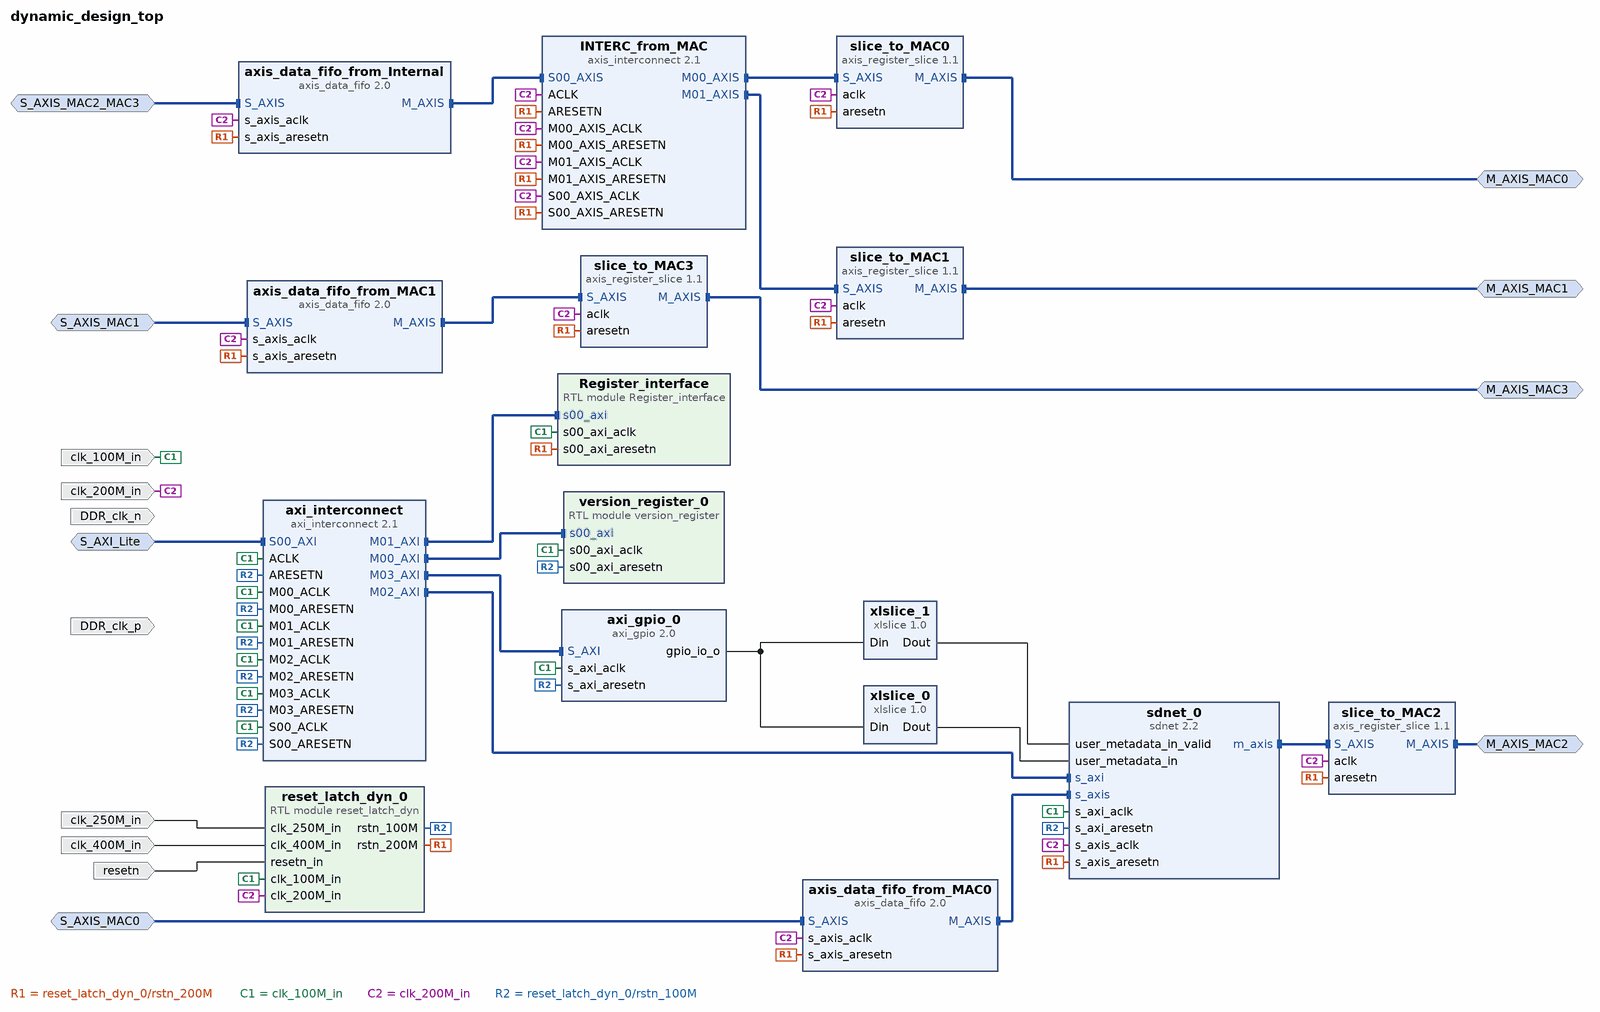
[diagram p0: block diagram of the top level]
# Vivado block design dynamic_design_top, xcu25-ffvc1760-2LV-e, Vivado 2020.1
create_bd_design dynamic_design_top

create_bd_intf_port -mode Master -vlnv xilinx.com:interface:axis_rtl:1.0 M_AXIS_MAC0
set_property -dict {CONFIG.FREQ_HZ 200000000} [get_bd_intf_ports M_AXIS_MAC0]
create_bd_intf_port -mode Master -vlnv xilinx.com:interface:axis_rtl:1.0 M_AXIS_MAC1
set_property -dict {CONFIG.FREQ_HZ 200000000} [get_bd_intf_ports M_AXIS_MAC1]
create_bd_intf_port -mode Master -vlnv xilinx.com:interface:axis_rtl:1.0 M_AXIS_MAC2
set_property -dict {CONFIG.FREQ_HZ 200000000} [get_bd_intf_ports M_AXIS_MAC2]
create_bd_intf_port -mode Master -vlnv xilinx.com:interface:axis_rtl:1.0 M_AXIS_MAC3
set_property -dict {CONFIG.FREQ_HZ 200000000} [get_bd_intf_ports M_AXIS_MAC3]
create_bd_intf_port -mode Slave -vlnv xilinx.com:interface:axis_rtl:1.0 S_AXIS_MAC0
set_property -dict [list \
  CONFIG.TDATA_NUM_BYTES 64 \
  CONFIG.TDEST_WIDTH 2 \
  CONFIG.TID_WIDTH 0 \
  CONFIG.TUSER_WIDTH 0 \
  CONFIG.HAS_TREADY 1 \
  CONFIG.HAS_TSTRB 0 \
  CONFIG.HAS_TKEEP 1 \
  CONFIG.HAS_TLAST 1 \
  CONFIG.FREQ_HZ 200000000 \
  CONFIG.LAYERED_METADATA undef \
] [get_bd_intf_ports S_AXIS_MAC0]
create_bd_intf_port -mode Slave -vlnv xilinx.com:interface:axis_rtl:1.0 S_AXIS_MAC1
set_property -dict [list \
  CONFIG.TDATA_NUM_BYTES 64 \
  CONFIG.TDEST_WIDTH 2 \
  CONFIG.TID_WIDTH 0 \
  CONFIG.TUSER_WIDTH 0 \
  CONFIG.HAS_TREADY 1 \
  CONFIG.HAS_TSTRB 0 \
  CONFIG.HAS_TKEEP 1 \
  CONFIG.HAS_TLAST 1 \
  CONFIG.FREQ_HZ 200000000 \
  CONFIG.LAYERED_METADATA undef \
] [get_bd_intf_ports S_AXIS_MAC1]
create_bd_intf_port -mode Slave -vlnv xilinx.com:interface:axis_rtl:1.0 S_AXIS_MAC2_MAC3
set_property -dict [list \
  CONFIG.TDATA_NUM_BYTES 64 \
  CONFIG.TDEST_WIDTH 2 \
  CONFIG.TID_WIDTH 0 \
  CONFIG.TUSER_WIDTH 0 \
  CONFIG.HAS_TREADY 1 \
  CONFIG.HAS_TSTRB 0 \
  CONFIG.HAS_TKEEP 1 \
  CONFIG.HAS_TLAST 1 \
  CONFIG.FREQ_HZ 200000000 \
  CONFIG.LAYERED_METADATA undef \
] [get_bd_intf_ports S_AXIS_MAC2_MAC3]
create_bd_intf_port -mode Slave -vlnv xilinx.com:interface:aximm_rtl:1.0 S_AXI_Lite
set_property -dict [list \
  CONFIG.DATA_WIDTH 32 \
  CONFIG.PROTOCOL AXI4LITE \
  CONFIG.FREQ_HZ 100000000 \
  CONFIG.ID_WIDTH 0 \
  CONFIG.ADDR_WIDTH 40 \
  CONFIG.AWUSER_WIDTH 0 \
  CONFIG.ARUSER_WIDTH 0 \
  CONFIG.WUSER_WIDTH 0 \
  CONFIG.RUSER_WIDTH 0 \
  CONFIG.BUSER_WIDTH 0 \
  CONFIG.READ_WRITE_MODE READ_WRITE \
  CONFIG.HAS_BURST 1 \
  CONFIG.HAS_LOCK 1 \
  CONFIG.HAS_PROT 1 \
  CONFIG.HAS_CACHE 1 \
  CONFIG.HAS_QOS 1 \
  CONFIG.HAS_REGION 0 \
  CONFIG.HAS_WSTRB 1 \
  CONFIG.HAS_BRESP 1 \
  CONFIG.HAS_RRESP 1 \
  CONFIG.SUPPORTS_NARROW_BURST 0 \
  CONFIG.NUM_READ_OUTSTANDING 2 \
  CONFIG.NUM_WRITE_OUTSTANDING 2 \
  CONFIG.MAX_BURST_LENGTH 1 \
  CONFIG.NUM_READ_THREADS 1 \
  CONFIG.NUM_WRITE_THREADS 1 \
  CONFIG.RUSER_BITS_PER_BYTE 0 \
  CONFIG.WUSER_BITS_PER_BYTE 0 \
] [get_bd_intf_ports S_AXI_Lite]
create_bd_port -dir I -type clk DDR_clk_n
set_property -dict {CONFIG.FREQ_HZ 100000000} [get_bd_ports DDR_clk_n]
create_bd_port -dir I -type clk DDR_clk_p
set_property -dict {CONFIG.FREQ_HZ 100000000} [get_bd_ports DDR_clk_p]
create_bd_port -dir I -type clk clk_100M_in
set_property -dict {CONFIG.FREQ_HZ 100000000} [get_bd_ports clk_100M_in]
create_bd_port -dir I -type clk clk_200M_in
set_property -dict [list \
  CONFIG.ASSOCIATED_BUSIF S_AXIS_MAC0:S_AXIS_MAC1:S_AXIS_MAC2_MAC3:M_AXIS_MAC0:M_AXIS_MAC1:M_AXIS_MAC2:M_AXIS_MAC3 \
  CONFIG.FREQ_HZ 200000000 \
] [get_bd_ports clk_200M_in]
create_bd_port -dir I -type clk clk_250M_in
set_property -dict {CONFIG.FREQ_HZ 250000000} [get_bd_ports clk_250M_in]
create_bd_port -dir I -type clk clk_400M_in
set_property -dict {CONFIG.FREQ_HZ 400000000} [get_bd_ports clk_400M_in]
create_bd_port -dir I -type rst resetn

create_bd_cell -type ip -vlnv xilinx.com:ip:axis_interconnect:2.1 INTERC_from_MAC
set_property -dict [list \
  CONFIG.ARB_ON_TLAST 1 \
  CONFIG.M00_AXIS_BASETDEST 0x00000002 \
  CONFIG.M00_AXIS_HIGHTDEST 0x00000002 \
  CONFIG.M00_FIFO_DEPTH 64 \
  CONFIG.M00_FIFO_MODE 1 \
  CONFIG.M00_HAS_REGSLICE 0 \
  CONFIG.M01_AXIS_BASETDEST 0x00000003 \
  CONFIG.M01_AXIS_HIGHTDEST 0x00000003 \
  CONFIG.M01_FIFO_DEPTH 64 \
  CONFIG.M01_FIFO_MODE 1 \
  CONFIG.M01_HAS_REGSLICE 0 \
  CONFIG.M02_FIFO_DEPTH 32 \
  CONFIG.M02_FIFO_MODE 1 \
  CONFIG.M02_HAS_REGSLICE 1 \
  CONFIG.M03_FIFO_DEPTH 32 \
  CONFIG.M03_FIFO_MODE 1 \
  CONFIG.M03_HAS_REGSLICE 1 \
  CONFIG.NUM_MI 2 \
  CONFIG.S00_FIFO_DEPTH 128 \
  CONFIG.S00_FIFO_MODE 1 \
  CONFIG.S00_HAS_REGSLICE 0 \
] [get_bd_cells INTERC_from_MAC]
create_bd_cell -type module -reference Register_interface Register_interface
create_bd_cell -type ip -vlnv xilinx.com:ip:axi_interconnect:2.1 axi_interconnect
set_property -dict [list \
  CONFIG.M00_HAS_REGSLICE 4 \
  CONFIG.M01_HAS_REGSLICE 4 \
  CONFIG.M02_HAS_REGSLICE 4 \
  CONFIG.M03_HAS_REGSLICE 4 \
  CONFIG.M04_HAS_REGSLICE 4 \
  CONFIG.M05_HAS_REGSLICE 4 \
  CONFIG.M06_HAS_REGSLICE 4 \
  CONFIG.M07_HAS_REGSLICE 4 \
  CONFIG.M08_HAS_REGSLICE 4 \
  CONFIG.M09_HAS_REGSLICE 4 \
  CONFIG.M10_HAS_REGSLICE 4 \
  CONFIG.M11_HAS_REGSLICE 4 \
  CONFIG.M12_HAS_REGSLICE 4 \
  CONFIG.M13_HAS_REGSLICE 4 \
  CONFIG.M14_HAS_REGSLICE 4 \
  CONFIG.M15_HAS_REGSLICE 4 \
  CONFIG.M16_HAS_REGSLICE 4 \
  CONFIG.NUM_MI 4 \
  CONFIG.S00_HAS_REGSLICE 4 \
] [get_bd_cells axi_interconnect]
create_bd_cell -type ip -vlnv xilinx.com:ip:axis_data_fifo:2.0 axis_data_fifo_from_Internal
set_property -dict [list \
  CONFIG.FIFO_DEPTH 64 \
  CONFIG.FIFO_MEMORY_TYPE auto \
  CONFIG.FIFO_MODE 2 \
  CONFIG.HAS_TKEEP 1 \
  CONFIG.TDATA_NUM_BYTES 64 \
  CONFIG.TDEST_WIDTH 2 \
] [get_bd_cells axis_data_fifo_from_Internal]
create_bd_cell -type ip -vlnv xilinx.com:ip:axis_data_fifo:2.0 axis_data_fifo_from_MAC0
set_property -dict [list \
  CONFIG.FIFO_DEPTH 64 \
  CONFIG.FIFO_MEMORY_TYPE auto \
  CONFIG.FIFO_MODE 2 \
  CONFIG.HAS_TKEEP 1 \
  CONFIG.TDATA_NUM_BYTES 64 \
  CONFIG.TDEST_WIDTH 2 \
] [get_bd_cells axis_data_fifo_from_MAC0]
create_bd_cell -type ip -vlnv xilinx.com:ip:axis_data_fifo:2.0 axis_data_fifo_from_MAC1
set_property -dict [list \
  CONFIG.FIFO_DEPTH 64 \
  CONFIG.FIFO_MEMORY_TYPE auto \
  CONFIG.FIFO_MODE 2 \
  CONFIG.HAS_TKEEP 1 \
  CONFIG.TDATA_NUM_BYTES 64 \
  CONFIG.TDEST_WIDTH 2 \
] [get_bd_cells axis_data_fifo_from_MAC1]
create_bd_cell -type module -reference reset_latch_dyn reset_latch_dyn_0
create_bd_cell -type ip -vlnv xilinx.com:ip:axis_register_slice:1.1 slice_to_MAC0
set_property -dict [list \
  CONFIG.HAS_TKEEP 1 \
  CONFIG.HAS_TLAST 1 \
  CONFIG.HAS_TREADY 1 \
  CONFIG.TDATA_NUM_BYTES 64 \
  CONFIG.TDEST_WIDTH 2 \
] [get_bd_cells slice_to_MAC0]
create_bd_cell -type ip -vlnv xilinx.com:ip:axis_register_slice:1.1 slice_to_MAC1
set_property -dict [list \
  CONFIG.HAS_TKEEP 1 \
  CONFIG.HAS_TLAST 1 \
  CONFIG.HAS_TREADY 1 \
  CONFIG.TDATA_NUM_BYTES 64 \
  CONFIG.TDEST_WIDTH 2 \
] [get_bd_cells slice_to_MAC1]
create_bd_cell -type ip -vlnv xilinx.com:ip:axis_register_slice:1.1 slice_to_MAC2
set_property -dict [list \
  CONFIG.HAS_TKEEP 1 \
  CONFIG.HAS_TLAST 1 \
  CONFIG.HAS_TREADY 1 \
  CONFIG.TDATA_NUM_BYTES 64 \
  CONFIG.TDEST_WIDTH 2 \
] [get_bd_cells slice_to_MAC2]
create_bd_cell -type ip -vlnv xilinx.com:ip:axis_register_slice:1.1 slice_to_MAC3
set_property -dict [list \
  CONFIG.HAS_TKEEP 1 \
  CONFIG.HAS_TLAST 1 \
  CONFIG.HAS_TREADY 1 \
  CONFIG.TDATA_NUM_BYTES 64 \
  CONFIG.TDEST_WIDTH 2 \
] [get_bd_cells slice_to_MAC3]
create_bd_cell -type ip -vlnv xilinx.com:ip:axi_gpio:2.0 axi_gpio_0
set_property -dict {CONFIG.C_ALL_OUTPUTS 1 CONFIG.C_GPIO_WIDTH 17} [get_bd_cells axi_gpio_0]
create_bd_cell -type ip -vlnv xilinx.com:ip:xlslice:1.0 xlslice_0
set_property -dict {CONFIG.DIN_FROM 15 CONFIG.DIN_WIDTH 17 CONFIG.DOUT_WIDTH 16} [get_bd_cells xlslice_0]
create_bd_cell -type ip -vlnv xilinx.com:ip:xlslice:1.0 xlslice_1
set_property -dict {CONFIG.DIN_FROM 16 CONFIG.DIN_TO 16 CONFIG.DIN_WIDTH 17 CONFIG.DOUT_WIDTH 1} [get_bd_cells xlslice_1]
create_bd_cell -type ip -vlnv xilinx.com:ip:sdnet:2.2 sdnet_0
set_property -dict [list \
  CONFIG.AXIS_CLK_FREQ_MHZ 200.0 \
  CONFIG.JSON_TIMESTAMP 1632994590 \
  CONFIG.M_AXI_HBM_ADDR_WIDTH 33 \
  CONFIG.M_AXI_HBM_DATA_WIDTH 256 \
  CONFIG.M_AXI_HBM_ID_WIDTH 6 \
  CONFIG.M_AXI_HBM_PROTOCOL 0 \
  CONFIG.P4_FILE /scratch/kestera/projects/DFX/U25N_DFX/dynamic/p4_example/p4_example.srcs/sources_1/echo.p4 \
  CONFIG.PKT_RATE 200.0 \
  CONFIG.S_AXI_ADDR_WIDTH 1 \
  CONFIG.USER_METADATA_ENABLES {metadata.echo_port {input true output true}} \
  CONFIG.USER_META_DATA_WIDTH 16 \
  CONFIG.USER_META_FORMAT {metadata.echo_port {length 16 start 0 end 15}} \
] [get_bd_cells sdnet_0]
create_bd_cell -type module -reference version_register version_register_0

# ---- connections ----

connect_bd_intf_net -intf_net S_AXIS_MAC0_1 [get_bd_intf_ports S_AXIS_MAC0] [get_bd_intf_pins axis_data_fifo_from_MAC0/S_AXIS]
connect_bd_intf_net [get_bd_intf_pins axis_data_fifo_from_MAC0/M_AXIS] [get_bd_intf_pins sdnet_0/s_axis]
connect_bd_intf_net [get_bd_intf_pins axi_interconnect/M03_AXI] [get_bd_intf_pins axi_gpio_0/S_AXI]
connect_bd_intf_net -intf_net S00_AXI_0_1 [get_bd_intf_ports S_AXI_Lite] [get_bd_intf_pins axi_interconnect/S00_AXI]
connect_bd_intf_net [get_bd_intf_pins INTERC_from_MAC/M01_AXIS] [get_bd_intf_pins slice_to_MAC1/S_AXIS]
connect_bd_intf_net [get_bd_intf_pins INTERC_from_MAC/M00_AXIS] [get_bd_intf_pins slice_to_MAC0/S_AXIS]
connect_bd_intf_net -intf_net S_AXIS_MAC1_1 [get_bd_intf_ports S_AXIS_MAC1] [get_bd_intf_pins axis_data_fifo_from_MAC1/S_AXIS]
connect_bd_intf_net -intf_net S_AXIS_MAC2_MAC3_1 [get_bd_intf_ports S_AXIS_MAC2_MAC3] [get_bd_intf_pins axis_data_fifo_from_Internal/S_AXIS]
connect_bd_intf_net [get_bd_intf_pins axi_interconnect/M00_AXI] [get_bd_intf_pins version_register_0/s00_axi]
connect_bd_intf_net [get_bd_intf_pins Register_interface/s00_axi] [get_bd_intf_pins axi_interconnect/M01_AXI]
connect_bd_intf_net [get_bd_intf_pins INTERC_from_MAC/S00_AXIS] [get_bd_intf_pins axis_data_fifo_from_Internal/M_AXIS]
connect_bd_intf_net [get_bd_intf_pins axis_data_fifo_from_MAC1/M_AXIS] [get_bd_intf_pins slice_to_MAC3/S_AXIS]
connect_bd_intf_net -intf_net dynamic_M_AXIS_MAC0 [get_bd_intf_ports M_AXIS_MAC0] [get_bd_intf_pins slice_to_MAC0/M_AXIS]
connect_bd_intf_net -intf_net dynamic_M_AXIS_MAC1 [get_bd_intf_ports M_AXIS_MAC1] [get_bd_intf_pins slice_to_MAC1/M_AXIS]
connect_bd_intf_net -intf_net dynamic_M_AXIS_MAC2 [get_bd_intf_ports M_AXIS_MAC2] [get_bd_intf_pins slice_to_MAC2/M_AXIS]
connect_bd_intf_net -intf_net dynamic_M_AXIS_MAC3 [get_bd_intf_ports M_AXIS_MAC3] [get_bd_intf_pins slice_to_MAC3/M_AXIS]
connect_bd_intf_net [get_bd_intf_pins sdnet_0/s_axi] [get_bd_intf_pins axi_interconnect/M02_AXI]
connect_bd_intf_net [get_bd_intf_pins sdnet_0/m_axis] [get_bd_intf_pins slice_to_MAC2/S_AXIS]
connect_bd_net -net ARESETN_1 [get_bd_pins reset_latch_dyn_0/rstn_200M] \
  [get_bd_pins INTERC_from_MAC/ARESETN] [get_bd_pins INTERC_from_MAC/M00_AXIS_ARESETN] \
  [get_bd_pins INTERC_from_MAC/M01_AXIS_ARESETN] [get_bd_pins INTERC_from_MAC/S00_AXIS_ARESETN] \
  [get_bd_pins Register_interface/s00_axi_aresetn] [get_bd_pins axis_data_fifo_from_Internal/s_axis_aresetn] \
  [get_bd_pins axis_data_fifo_from_MAC0/s_axis_aresetn] [get_bd_pins axis_data_fifo_from_MAC1/s_axis_aresetn] \
  [get_bd_pins slice_to_MAC0/aresetn] [get_bd_pins slice_to_MAC1/aresetn] [get_bd_pins slice_to_MAC2/aresetn] \
  [get_bd_pins slice_to_MAC3/aresetn] [get_bd_pins sdnet_0/s_axis_aresetn]
connect_bd_net [get_bd_ports clk_100M_in] \
  [get_bd_pins Register_interface/s00_axi_aclk] [get_bd_pins axi_interconnect/ACLK] [get_bd_pins axi_interconnect/M00_ACLK] \
  [get_bd_pins axi_interconnect/M01_ACLK] [get_bd_pins axi_interconnect/S00_ACLK] [get_bd_pins reset_latch_dyn_0/clk_100M_in] \
  [get_bd_pins axi_gpio_0/s_axi_aclk] [get_bd_pins axi_interconnect/M03_ACLK] [get_bd_pins axi_interconnect/M02_ACLK] \
  [get_bd_pins sdnet_0/s_axi_aclk] [get_bd_pins version_register_0/s00_axi_aclk]
connect_bd_net [get_bd_ports clk_200M_in] \
  [get_bd_pins INTERC_from_MAC/ACLK] [get_bd_pins INTERC_from_MAC/M00_AXIS_ACLK] [get_bd_pins INTERC_from_MAC/M01_AXIS_ACLK] \
  [get_bd_pins INTERC_from_MAC/S00_AXIS_ACLK] [get_bd_pins axis_data_fifo_from_Internal/s_axis_aclk] \
  [get_bd_pins axis_data_fifo_from_MAC0/s_axis_aclk] [get_bd_pins axis_data_fifo_from_MAC1/s_axis_aclk] \
  [get_bd_pins reset_latch_dyn_0/clk_200M_in] [get_bd_pins slice_to_MAC0/aclk] [get_bd_pins slice_to_MAC1/aclk] \
  [get_bd_pins slice_to_MAC2/aclk] [get_bd_pins slice_to_MAC3/aclk] [get_bd_pins sdnet_0/s_axis_aclk]
connect_bd_net [get_bd_ports clk_250M_in] [get_bd_pins reset_latch_dyn_0/clk_250M_in]
connect_bd_net [get_bd_ports clk_400M_in] [get_bd_pins reset_latch_dyn_0/clk_400M_in]
connect_bd_net [get_bd_pins reset_latch_dyn_0/rstn_100M] \
  [get_bd_pins axi_interconnect/ARESETN] [get_bd_pins axi_interconnect/M00_ARESETN] \
  [get_bd_pins axi_interconnect/M01_ARESETN] [get_bd_pins axi_interconnect/S00_ARESETN] \
  [get_bd_pins axi_gpio_0/s_axi_aresetn] [get_bd_pins axi_interconnect/M02_ARESETN] \
  [get_bd_pins axi_interconnect/M03_ARESETN] [get_bd_pins sdnet_0/s_axi_aresetn] \
  [get_bd_pins version_register_0/s00_axi_aresetn]
connect_bd_net [get_bd_ports resetn] [get_bd_pins reset_latch_dyn_0/resetn_in]
connect_bd_net [get_bd_pins axi_gpio_0/gpio_io_o] [get_bd_pins xlslice_1/Din] [get_bd_pins xlslice_0/Din]
connect_bd_net [get_bd_pins xlslice_0/Dout] [get_bd_pins sdnet_0/user_metadata_in]
connect_bd_net [get_bd_pins xlslice_1/Dout] [get_bd_pins sdnet_0/user_metadata_in_valid]

# ---- address map ----
assign_bd_address -offset 0x00800C0000 -range 64K -target_address_space [get_bd_addr_spaces S_AXI_Lite] [get_bd_addr_segs version_register_0/s00_axi/reg0]
assign_bd_address -offset 0x00800D0000 -range 64K -target_address_space [get_bd_addr_spaces S_AXI_Lite] [get_bd_addr_segs Register_interface/s00_axi/reg0]
assign_bd_address -offset 0x00800E0000 -range 64K -target_address_space [get_bd_addr_spaces S_AXI_Lite] [get_bd_addr_segs axi_gpio_0/S_AXI/Reg]

validate_bd_design
save_bd_design
